# Altium schematic sheet RELAY20.SchDoc
size A
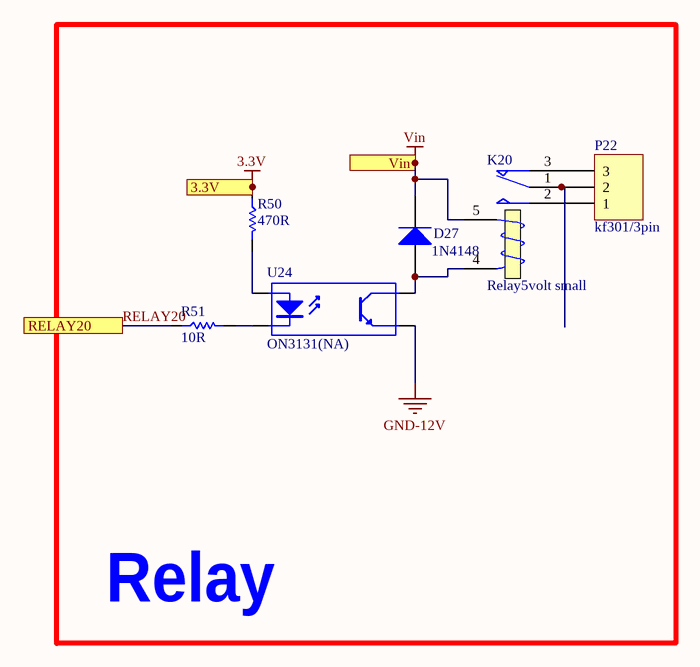
[diagram p0: RELAY20.SchDoc]

## Parts
D27  1N4148  [sod123]
K20  Relay5volt small  [relay5_childern]
P22  kf301/3pin  [Blue Connector 1*3 -kf301]
R50  470R  [0805/resistor]
R51  10R  [0805/resistor]
U24  ON3131(NA)  [OPTO_COUPLER]

## Blocks framed on the sheet
Relay: D27 K20 P22 R50 R51 U24

## Ports
3.3V, RELAY20, Vin

## Nets
3.3V: R50.1 ; port 3.3V
GND-12V: U24.3(E)
Vin: D27.K K20.5 ; port Vin
RELAY20: R51.1 ; port RELAY20
NetD27_A: D27.A K20.4(T2) U24.4(C)
NetK20_1: K20.1(COM) P22.2
NetK20_2: K20.2(NO) P22.1
NetK20_3: K20.3(T1) P22.3
NetR50_2: R50.2 U24.1(A)
NetR51_2: R51.2 U24.2(K)

## Library data of the parts
D27 = Diode 1N4007: 1 Amp General Purpose Rectifier; Published: 8-Jun-2000; LatestRevisionDate: 17-Jul-2002; LatestRevisionNote: Re-released for DXP Platform.; DatasheetVersion: 1998; PackageVersion: Aug-1999; PackageReference: DO-41; Publisher: Altium Limited; PackageDescription: Diode, Axial; Body 5.2 x 2.7 mm (LxDia. max), Lead Dia. 0.86 mm (max); Code_JEDEC: DO-204-AL; ComponentLink1Description: Manufacturer Link; ComponentLink1URL: http://www.fairchildsemi.com/; ComponentLink2Description: Datasheet; ComponentLink2URL: http://www.fairchildsemi.com/ds/1N%2F1N4001.pdf
K20 = Relay: SPDT Relay; Published: 8-Jun-2000; LatestRevisionDate: 17-Jul-2002; LatestRevisionNote: Re-released for DXP Platform.; PackageReference: MODULE5B; Publisher: Altium Limited
P22 = Header 3: LatestRevisionDate: 17-Jul-2002; LatestRevisionNote: Re-released for DXP Platform.; Publisher: Altium Limited
R50 R51 = Resistor: Tolerance: 5%; Power: 1/8 W
  R50: Value: 470R
  R51: Value: 10R
U24 = Optoisolator1: 4-Pin Phototransistor Optocoupler; Published: 24-Mar-1999; LatestRevisionDate: 04-Mar-2005; LatestRevisionNote: Sch pins 3 & 4 Swapped.; DatasheetVersion: Nov-2003; PackageReference: DIP-4; Publisher: Altium Limited